# Altium schematic sheet Power.SchDoc
size A4; SheetNumber: 1; SheetTotal: 4
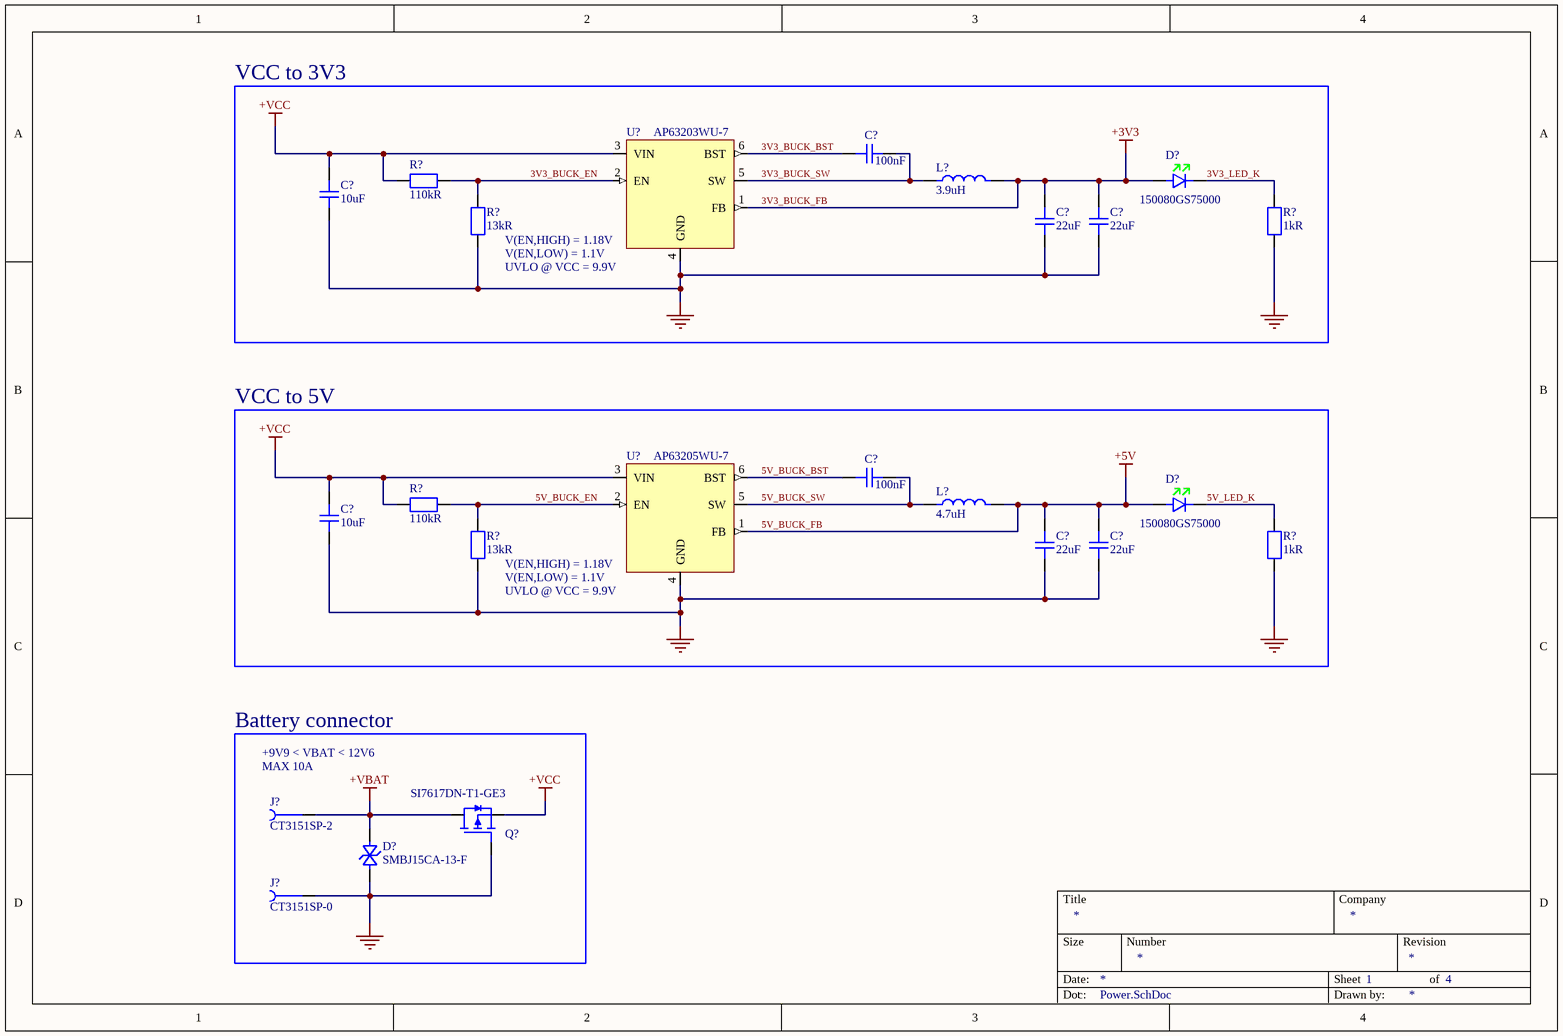
[diagram p0: Power.SchDoc]

## Parts
(Parts that share a designator on the sheet are numbered #1, #2 ... from top to bottom, then left to right.)
C?#1  value 100nF  [C_Yageo_CC_0402_A]  (hidden comment: CC0402MRX5R6BB104)
C?#2  value 10uF  [C_Yageo_CC_0805_A]  (hidden comment: CC0805KRX5R7BB106)
C?#3  value 22uF  [C_Yageo_CC_0805_A]  (hidden comment: CC0805MKX5R6BB226)
C?#4  value 22uF  [C_Yageo_CC_0805_A]  (hidden comment: CC0805MKX5R6BB226)
C?#5  value 100nF  [C_Yageo_CC_0402_A]  (hidden comment: CC0402MRX5R6BB104)
C?#6  value 10uF  [C_Yageo_CC_0805_A]  (hidden comment: CC0805KRX5R7BB106)
C?#7  value 22uF  [C_Yageo_CC_0805_A]  (hidden comment: CC0805MKX5R6BB226)
C?#8  value 22uF  [C_Yageo_CC_0805_A]  (hidden comment: CC0805MKX5R6BB226)
D?#1  150080GS75000  [D_LED_We_150080GS75000]
D?#2  150080GS75000  [D_LED_We_150080GS75000]
D?#3  SMBJ15CA-13-F  [D_TVS_BI_Diodes_SMBJ15CA-13-F_A]
J?#1  CT3151SP-2  [J_CalTest_CT3151SP-2]
J?#2  CT3151SP-0  [J_CalTest_CT3151SP-0]
L?#1  value 3.9uH  [L_Murata_1255AY-XXXX=P3]  (hidden comment: 1255AY-3R9N=P3)
L?#2  value 4.7uH  [L_Murata_1255AY-XXXX=P3]  (hidden comment: 1255AY-4R7M=P3)
Q?  SI7617DN-T1-GE3  [Q_Vishay_SI7617DN-T1-GE3]
R?#1  value 110kR  [R_Yageo_RCL_0402_A]  (hidden comment: RC0402FR-07110KL)
R?#2  value 13kR  [R_Yageo_RCL_0402_A]  (hidden comment: RC0402FR-0713KL)
R?#3  value 1kR  [R_Yageo_RCL_0402_A]  (hidden comment: RC0402FR-071KL)
R?#4  value 110kR  [R_Yageo_RCL_0402_A]  (hidden comment: RC0402FR-07110KL)
R?#5  value 13kR  [R_Yageo_RCL_0402_A]  (hidden comment: RC0402FR-0713KL)
R?#6  value 1kR  [R_Yageo_RCL_0402_A]  (hidden comment: RC0402FR-071KL)
U?#1  AP63203WU-7  [U_Diodes_AP623xx]
U?#2  AP63205WU-7  [U_Diodes_AP623xx]

## Blocks framed on the sheet
VCC to 3V3: C?#1-C?#4 D?#1 L?#1 R?#1-R?#3 U?#1
VCC to 5V: C?#5-C?#8 D?#2 L?#2 R?#4-R?#6 U?#2
Battery connector: D?#3 J?#1 J?#2 Q?

## Nets
3V3_BUCK_FB: C?#3.2 C?#4.2 D?#1.1 L?#1.2 U?#1.1(FB)  [also labelled +3V3]
5V_BUCK_FB: C?#7.2 C?#8.2 D?#2.1 L?#2.2 U?#2.1(FB)  [also labelled +5V]
+VBAT: D?#3.1 J?#1.1 Q?.1(D)
+VCC: C?#2.2 C?#6.2 Q?.3(S) R?#1.2 R?#4.2 U?#1.3(VIN) U?#2.3(VIN)
GND: C?#2.1 C?#3.1 C?#4.1 C?#6.1 C?#7.1 C?#8.1 D?#3.2 J?#2.1 Q?.2(G) R?#2.1 R?#3.1 R?#5.1 R?#6.1 U?#1.4(GND) U?#2.4(GND)
3V3_BUCK_BST: C?#1.2 U?#1.6(BST)
3V3_BUCK_EN: R?#1.1 R?#2.2 U?#1.2(EN)
3V3_BUCK_SW: C?#1.1 L?#1.1 U?#1.5(SW)
3V3_LED_K: D?#1.2 R?#3.2
5V_BUCK_BST: C?#5.2 U?#2.6(BST)
5V_BUCK_EN: R?#4.1 R?#5.2 U?#2.2(EN)
5V_BUCK_SW: C?#5.1 L?#2.1 U?#2.5(SW)
5V_LED_K: D?#2.2 R?#6.2

## Notes on the sheet
- (near U?#1) V(EN,HIGH) = 1.18V
- V(EN,LOW) = 1.1V
- (near U?#1) UVLO @ VCC = 9.9V
- (near U?#2) V(EN,HIGH) = 1.18V
- (near U?#2) UVLO @ VCC = 9.9V
- +9V9 < VBAT < 12V6
- (near J?#1) MAX 10A
- Title
- Company
- Size
- Date:
- Number
- Sheet
- Revision
- of
- Doc:
- Drawn by:

## Library data of the parts
C?#1 C?#5 = CMP-001-00009-8: Multilayer Ceramic Capacitor, 0.1 uF, 25 V, ± 20%, X7R, 0402 [1005 Metric]; Dielectric: X5R; Temperature Coefficient: 30ppm/°C; Voltage Rating: 10V; ComponentLink1URL: https://www.yageo.com/upload/media/product/app/datasheet/mlcc/upy-gphc_x5r_4v-to-50v.pdf; Halogen Free: Halogen Free; Height: 550um; Tolerance: 20%; Lead Free: Lead Free; Voltage Rating (DC): 10V; Case/Package: 0402; ComponentLink1Description: Datasheet; RoHS Compliant: Yes; Packaging: Tape and Reel; Case Code (Imperial): 0402; Material: Ceramic; Case Code (Metric): 1005; Max Operating Temperature: 85°C; Mounting Technology: Surface Mount; Min Operating Temperature: -55°C; Series: CC
C?#2 C?#6 = CMP-001-00018-3: 0805 10 uF 16 V ±10% Tolerance X5R Multilayer Ceramic Chip Capacitor; Voltage Rating (DC): 16V; RoHS Compliant: Yes; Case Code (Metric): 2012; Voltage Rating: 16V; Mounting Technology: Surface Mount; Tolerance: 10%; Max Operating Temperature: 85°C; Case/Package: 0805; Halogen Free: Halogen Free; Case Code (Imperial): 0805; Series: CC; Lead Free: Lead Free; ComponentLink1URL: https://www.yageo.com/upload/media/product/app/datasheet/mlcc/upy-gphc_x5r_4v-to-50v.pdf; Dielectric: X5R; Min Operating Temperature: -55°C; Packaging: Cut Tape; ComponentLink1Description: Datasheet
C?#3 C?#4 C?#7 C?#8 = CMP-001-00014-5: Multilayer Ceramic Capacitor, 22 uF, 10 V, ± 20%, X5R, 0805 [2012 Metric]; Voltage Rating (DC): 10V; Tolerance: 20%; ComponentLink1URL: https://www.yageo.com/upload/media/product/app/datasheet/mlcc/upy-gphc_x5r_4v-to-50v.pdf; Depth: 1.25mm; Width: 0.049inch; Termination: SMD/SMT; Packaging: Tape and Reel; Radiation Hardening: No; Min Operating Temperature: -55°C; RoHS Compliant: Yes; ComponentLink1Description: Datasheet; Length: 2mm; Dielectric: X5R; Case/Package: 0805; Case Code (Metric): 2012; Max Operating Temperature: 85°C; Weight: 0.000194oz; Case Code (Imperial): 0805; Lead Free: Lead Free; Mounting Technology: Surface Mount; Thickness: 0.057inch; Series: CC; Voltage Rating: 10V; Halogen Free: Halogen Free
D?#1 D?#2 = CMP-007-00000-6: WURTH ELEKTRONIK - 150080GS75000 - LED, Green, SMD, 0805, 30 mA, 3.2 V, 520 nm; Forward Current: 30mA; Forward Voltage: 3.2V; Luminous Intensity: 450mcd; Max Reverse Voltage (DC): 5V; Lens Transparency: Clear; Power Dissipation: 105mW; Lens Style: Clear,Flat,Rectangular; Lens Size: 1.25mm; Viewing Angle: 140°; Test Current: 20mA; Dominant Wavelength: 520nm; Lens Color: Colorless; Case Code (Imperial): 0805; Min Operating Temperature: -40°C; Case/Package: 0805; RoHS Compliant: Yes; Color: Green; Mounting Technology: Surface Mount; Case Code (Metric): 2012; Series: WL-SMCW; Reach SVHC Compliant: Unknown; Width: 1.25mm; Packaging: Cut Tape; Max Operating Temperature: 85°C; ComponentLink1Description: Datasheet; Length: 2mm; Reverse Voltage: 5V; Package Quantity: 1; Height: 0.8mm; ComponentLink1URL: https://www.we-online.com/components/products/datasheet/150080GS75000.pdf; Wavelength: 520nm
D?#3 = CMP-004-00000-8: Tvs Diode, Bidir, 15V, 600W, Do-214Aa Rohs Compliant: Yes; Max Reverse Leakage Current: 5uA; Reverse Breakdown Voltage: 16.7V; Breakdown Voltage: 19.2V; Clamping Voltage: 24.4V; Power Line Protection: No; Max Surge Current: 24A; Number of Bidirectional Channels: 1; Test Current: 1mA; Value: 280pF; Polarity: Bidirectional; Diode Type: ZENER; Power Dissipation: 600W; Max Operating Temperature: 150°C; Package Quantity: 3000; Min Breakdown Voltage: 16.7V; Width: 3.9mm; Series: SMBJ; Peak Pulse Power: 600W; Mounting Technology: Surface Mount; Working Voltage: 15V; Peak Pulse Current: 24A; Min Operating Temperature: -55°C; Max Output current: 24A; Pins: 2; Termination: SMD/SMT; Leakage Current: 5uA; ComponentLink1Description: Datasheet; Max Breakdown Voltage: 19.2V; Case/Package: SMB; Number of Elements: 1; Max Power Dissipation: 600W; ComponentLink1URL: https://www.bourns.com/docs/Product-Datasheets/SMBJ.pdf; Lead Free: Lead Free; Packaging: Tape and Reel; Clamping Voltage-Max: 24.4V; RoHS Compliant: Yes; Length: 4.57mm; Voltage Rating (DC): 15V; Direction: Bidirectional; Radiation Hardening: No; Height: 2.62mm; Reverse Standoff Voltage: 15V
J?#1 = CMP-002-00001-9: Conn 4mm Safety Banana Jack F 1 POS Solder RA Thru-Hole 1 Port Bag; pin to pad: 1>1+2+3+4; Body Material: Nylon,Polyamide,PA66; Insulation: Mating End Insulated; Gender: Female; Min Operating Temperature: -20°C; Termination: Solder; ComponentLink1Description: Datasheet; Mounting Technology: Through Hole,Panel; Max Operating Temperature: 80°C; Color: Red; ComponentLink1URL: https://mm.digikey.com/Volume0/opasdata/d220001/medias/docus/4846/DS_1768_Catalog.pdf; Contact Material: Brass; Contact Plating: Nickel; Series: Cal Test; Packaging: Bulk
J?#2 = CMP-002-00000-11: Conn 4mm Safety Banana Jack F 1 POS Solder RA Thru-Hole 1 Port Bag; pin to pad: 1>1+2+3+4; Body Material: Nylon,Polyamide,PA66; Insulation: Mating End Insulated; Gender: Female; Packaging: Bulk; Series: Cal Test; Color: Black; Min Operating Temperature: -20°C; Contact Material: Brass; ComponentLink1URL: https://mm.digikey.com/Volume0/opasdata/d220001/medias/docus/4846/DS_1768_Catalog.pdf; Mounting Technology: Through Hole,Panel; Contact Plating: Nickel; ComponentLink1Description: Datasheet; Max Operating Temperature: 80°C; Termination: Solder
L?#1 = CMP-006-00002-2: Inductor Power Shielded Wirewound 3.9uH 30% 100KHz Ferrite 4.2A 0.0264Ohm DCR 2424 T/R; DC Resistance (DCR): 26.4mR; Saturation Current: 4.7A; Core Material: Ferrite; Tolerance: 30%; Shielding: Shielded; Length: 0.248inch; Packaging: Cut Tape; Min Operating Temperature: -40°C; ComponentLink1URL: https://search.murata.co.jp/Ceramy/image/img/P02/J(E)TE243B-0037_DG6045C_reference.pdf; RoHS Compliant: Yes; ComponentLink1Description: Datasheet; Height - Seated (Max): 0.177inch; Max Operating Temperature: 85°C; Mounting Technology: Surface Mount; Series: -; Case/Package: Nonstandard; Width: 0.248inch; Current Rating: 4.2A; Test Frequency: 100kHz
L?#2 = CMP-006-00001-5: Inductor Power Shielded Wirewound 4.7uH 20% 100KHz Ferrite 4A 0.0276Ohm DCR 2424 T/R; DC Resistance (DCR): 27.6mR; Current Rating: 4.5A; ComponentLink1Description: Datasheet; Packaging: Cut Tape; Height - Seated (Max): 0.177inch; ESR: 27.6mR; Core Material: Ferrite; Inductance Tolerance: 20%; ComponentLink1URL: https://search.murata.co.jp/Ceramy/image/img/P02/J(E)TE243B-0037_DG6045C_reference.pdf; Width: 0.248inch; Saturation Current: 4.5A; Min Operating Temperature: -40°C; Case/Package: Nonstandard; Series: DG6045C; RoHS Compliant: Yes; Tolerance: 20%; Length: 0.248inch; Test Frequency: 100kHz; Shielding: Shielded; Max Operating Temperature: 85°C; Height: 4.5mm; Max DC Current: 4A; RMS Current (Irms): 4A; Mounting Technology: Surface Mount
Q? = CMP-00000-6: P CHANNEL MOSFET, -30V, 35A; Transistor; Transistor Polarity: P Channel; Continuous Drain Current Id: -35A; Source; pin to pad: 1>5+6+7+8 2>4 3>1+2+3; Rise Time: 43ns; Drain to Source Resistance: 12.3mR; Turn-Off Delay Time: 30ns; Turn-On Delay Time: 40ns; Threshold Voltage: -2.5V; Max Power Dissipation: 52W; Fall Time: 11ns; Power Dissipation: 3.7W; Polarity: P-CHANNEL; Number of Elements: 1; Input Capacitance: 1.8nF; Gate to Source Voltage (Vgs): 25V; Drain to Source Breakdown Voltage: -30V; Pins: 8; Max Operating Temperature: 150°C; ComponentLink1Description: Datasheet; Continuous Drain Current (ID): -35A; Mounting Technology: Surface Mount; Rds On Max: 12.3mR; Packaging: Tape and Reel; ComponentLink1URL: https://www.vishay.com/docs/65164/si7617dn.pdf; Min Operating Temperature: -55°C; Reach SVHC Compliant: No; Drain to Source Voltage (Vdss): -30V; RoHS Compliant: Yes; Package Quantity: 3000; Number of Channels: 1; Lead Free: Lead Free; Series: TrenchFET®; Radiation Hardening: No; Height: 1.12mm
R?#1 R?#4 = CMP-009-00000-7: SMD Chip Resistor, 110 kOhm, ± 1%, 63 mW, 0402 [1005 Metric], Thick Film, General Purpose; Max Power Dissipation: 63mW; Voltage Rating (DC): 50V; Temperature Coefficient: 100ppm/°C; Tolerance: 1%; Case Code (Metric): 1005; Case/Package: 0402; ComponentLink1Description: Datasheet; Depth: 0.5mm; Length: 1mm; Packaging: Tape and Reel; Max Operating Temperature: 155°C; Reach SVHC Compliant: Unknown; Case Code (Imperial): 0402; ComponentLink1URL: https://www.yageo.com/upload/media/product/products/datasheet/rchip/PYu-RC_Group_51_RoHS_L_12.pdf; Termination: SMD/SMT; Construction: Rectangular; RoHS Compliant: Yes; Min Operating Temperature: -55°C; Working Voltage: 50V; Technology: THICK FILM; Resistor Type: Thick Film; Military Standard: Not; Number of Terminations: 2; Voltage Rating: 50V; Series: RC; Power Rating: 63mW; Features: Moisture Resistant; Resistance Tolerance: 1%
R?#2 R?#5 = CMP-009-00001-7: SMD Chip Resistor, 13 kOhm, ± 1%, 63 mW, 0402 [1005 Metric], Thick Film, General Purpose; Temperature Coefficient: 100ppm/°C; Voltage Rating: 50V; Max Power Dissipation: 63mW; Power Rating: 62.5mW; ComponentLink1Description: Datasheet; Mounting Technology: Surface Mount; Max Operating Temperature: 155°C; Technology: THICK FILM; Package Quantity: 10000; Case Code (Imperial): 0402; Number of Terminations: 2; Lead Free: Lead Free; Working Voltage: 50V; Min Operating Temperature: -55°C; Width: 0.02inch; Height: 0.016inch; Tolerance: 1%; Packaging: Tape and Reel; Length: 0.039inch; Features: Moisture Resistant; Case Code (Metric): 1005; Case/Package: 0402; Depth: 0.5mm; Termination: SMD/SMT; ComponentLink1URL: https://www.yageo.com/upload/media/product/products/datasheet/rchip/PYu-RC_Group_51_RoHS_L_12.pdf; Voltage Rating (DC): 50V; Series: RC; RoHS Compliant: Yes
R?#3 R?#6 = CMP-009-00002-7: SMD Chip Resistor, 1 kOhm, ± 1%, 62.5 mW, 0402 [1005 Metric], Thick Film, General Purpose; Temperature Coefficient: 100ppm/°C; Voltage Rating (AC): 50V; Power Rating: 62.5mW; Max Power Dissipation: 63mW; Features: Moisture Resistant; Width: 0.5mm; Resistor Type: Thick Film; Packaging: Tape and Reel; Max Operating Temperature: 155°C; Construction: Rectangular; Reach SVHC Compliant: No; Termination: SMD/SMT; Voltage Rating (DC): 50V; Tolerance: 1%; ComponentLink1Description: Datasheet; Number of Terminations: 2; Depth: 0.5mm; Resistance Tolerance: 1%; ComponentLink1URL: https://www.yageo.com/upload/media/product/products/datasheet/rchip/PYu-RC_Group_51_RoHS_L_12.pdf; Height: 0.32mm; Technology: THICK FILM; RoHS Compliant: Yes; Min Operating Temperature: -55°C; Lead Free: Lead Free; Military Standard: Not; Series: RC; Case/Package: 0402; Case Code (Imperial): 0402; Pins: 2; Case Code (Metric): 1005; Voltage Rating: 50V; Length: 1mm
U?#1 = CMP-019-00004-6: AP63203 Series 3.3 V 2 A SMT Fixed Low IQ Synchronous Buck - TSOT-26; Max Duty Cycle: 100%; Output Voltage: 3.3V; Number of Outputs: 1; Max Supply Voltage: 32V; Switching Frequency: 1.1MHz; Min Supply Voltage: 3.8V; Nominal Supply Current: 22uA; Output Current: 2A; Min Operating Temperature: -40°C; ComponentLink1URL: https://www.diodes.com/assets/Datasheets/AP63200-AP63201-AP63203-AP63205.pdf; ComponentLink1Description: Datasheet; Max Operating Temperature: 85°C; Height: 1mm
U?#2 = CMP-019-00003-6: AP63205 Series 32 V 2 A 1.1 MHz Synchronous Buck Converter -TSOT-26; Number of Outputs: 1; Max Duty Cycle: 100%; Output Current: 2A; Switching Frequency: 1.1MHz; Max Supply Voltage: 32V; Output Voltage: 5V; Nominal Supply Current: 22uA; Min Supply Voltage: 3.8V; ComponentLink1URL: https://www.diodes.com/assets/Datasheets/AP63200-AP63201-AP63203-AP63205.pdf; Min Operating Temperature: -40°C; Height: 1mm; Max Operating Temperature: 85°C; ComponentLink1Description: Datasheet